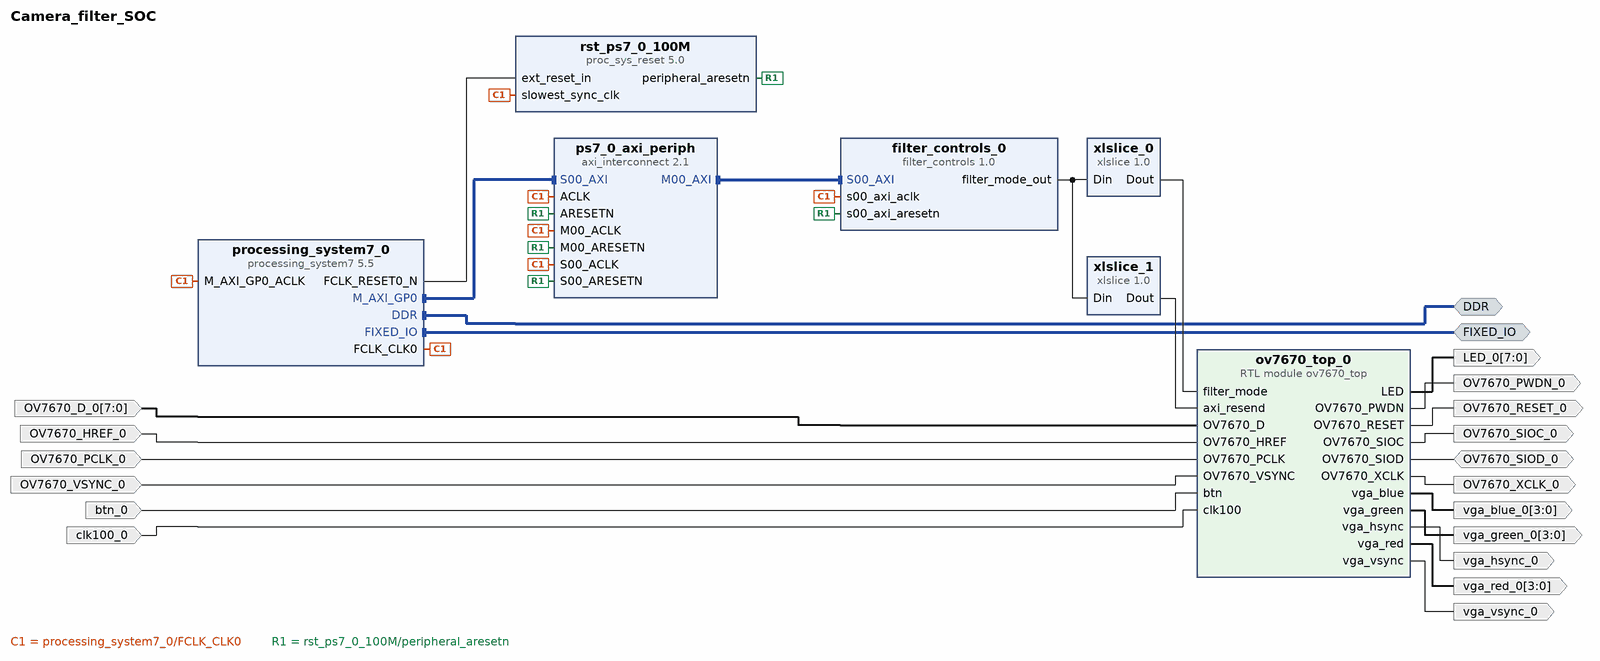
[diagram p0: block diagram of the top level]
# Vivado block design Camera_filter_SOC, xc7z020clg484-1, Vivado 2023.2
create_bd_design Camera_filter_SOC

create_bd_intf_port -mode Master -vlnv xilinx.com:interface:ddrx_rtl:1.0 DDR
create_bd_intf_port -mode Master -vlnv xilinx.com:display_processing_system7:fixedio_rtl:1.0 FIXED_IO
create_bd_port -dir I clk100_0
create_bd_port -dir O OV7670_SIOC_0
create_bd_port -dir IO OV7670_SIOD_0
create_bd_port -dir O -type rst OV7670_RESET_0
create_bd_port -dir O OV7670_PWDN_0
create_bd_port -dir I OV7670_VSYNC_0
create_bd_port -dir I OV7670_HREF_0
create_bd_port -dir I OV7670_PCLK_0
create_bd_port -dir O OV7670_XCLK_0
create_bd_port -dir O -from 7 -to 0 LED_0
create_bd_port -dir I -from 7 -to 0 OV7670_D_0
create_bd_port -dir O -from 3 -to 0 vga_red_0
create_bd_port -dir O -from 3 -to 0 vga_green_0
create_bd_port -dir O -from 3 -to 0 vga_blue_0
create_bd_port -dir O vga_hsync_0
create_bd_port -dir O vga_vsync_0
create_bd_port -dir I btn_0

create_bd_cell -type ip -vlnv xilinx.com:ip:processing_system7:5.5 processing_system7_0
set_property -dict [list \
  CONFIG.PCW_APU_PERIPHERAL_FREQMHZ 650 \
  CONFIG.PCW_ENET0_ENET0_IO {MIO 16 .. 27} \
  CONFIG.PCW_ENET0_GRP_MDIO_ENABLE 1 \
  CONFIG.PCW_ENET0_GRP_MDIO_IO EMIO \
  CONFIG.PCW_ENET0_PERIPHERAL_ENABLE 1 \
  CONFIG.PCW_ENET0_RESET_ENABLE 0 \
  CONFIG.PCW_ENET_RESET_ENABLE 1 \
  CONFIG.PCW_ENET_RESET_SELECT {Share reset pin} \
  CONFIG.PCW_FPGA0_PERIPHERAL_FREQMHZ 100 \
  CONFIG.PCW_GPIO_MIO_GPIO_ENABLE 1 \
  CONFIG.PCW_GPIO_MIO_GPIO_IO MIO \
  CONFIG.PCW_I2C_RESET_ENABLE 1 \
  CONFIG.PCW_PRESET_BANK1_VOLTAGE {LVCMOS 1.8V} \
  CONFIG.PCW_QSPI_GRP_FBCLK_ENABLE 1 \
  CONFIG.PCW_QSPI_GRP_FBCLK_IO {MIO 8} \
  CONFIG.PCW_QSPI_GRP_SINGLE_SS_ENABLE 1 \
  CONFIG.PCW_QSPI_GRP_SINGLE_SS_IO {MIO 1 .. 6} \
  CONFIG.PCW_QSPI_PERIPHERAL_ENABLE 1 \
  CONFIG.PCW_QSPI_QSPI_IO {MIO 1 .. 6} \
  CONFIG.PCW_SD0_GRP_CD_ENABLE 1 \
  CONFIG.PCW_SD0_GRP_CD_IO {MIO 47} \
  CONFIG.PCW_SD0_GRP_WP_ENABLE 1 \
  CONFIG.PCW_SD0_GRP_WP_IO EMIO \
  CONFIG.PCW_SD0_PERIPHERAL_ENABLE 1 \
  CONFIG.PCW_SD0_SD0_IO {MIO 40 .. 45} \
  CONFIG.PCW_SDIO_PERIPHERAL_FREQMHZ 50 \
  CONFIG.PCW_SINGLE_QSPI_DATA_MODE x4 \
  CONFIG.PCW_TTC0_PERIPHERAL_ENABLE 1 \
  CONFIG.PCW_TTC0_TTC0_IO EMIO \
  CONFIG.PCW_UART1_PERIPHERAL_ENABLE 1 \
  CONFIG.PCW_UART1_UART1_IO {MIO 48 .. 49} \
  CONFIG.PCW_UART_PERIPHERAL_FREQMHZ 100 \
  CONFIG.PCW_UIPARAM_DDR_FREQ_MHZ 525 \
  CONFIG.PCW_UIPARAM_DDR_PARTNO {MT41K128M16 JT-125} \
  CONFIG.PCW_USB0_PERIPHERAL_ENABLE 1 \
  CONFIG.PCW_USB0_RESET_ENABLE 1 \
  CONFIG.PCW_USB0_RESET_IO {MIO 46} \
  CONFIG.PCW_USB0_USB0_IO {MIO 28 .. 39} \
  CONFIG.PCW_USB_RESET_ENABLE 1 \
  CONFIG.PCW_USB_RESET_SELECT {Share reset pin} \
] [get_bd_cells processing_system7_0]
# 217 more settings of processing_system7_0 are not shown: defaults, MIO pin electricals, DDR timing, and values the tool derives
create_bd_cell -type ip -vlnv xilinx.com:user:filter_controls:1.0 filter_controls_0
create_bd_cell -type ip -vlnv xilinx.com:ip:axi_interconnect:2.1 ps7_0_axi_periph
set_property -dict {CONFIG.NUM_MI 1} [get_bd_cells ps7_0_axi_periph]
create_bd_cell -type ip -vlnv xilinx.com:ip:proc_sys_reset:5.0 rst_ps7_0_100M
create_bd_cell -type module -reference ov7670_top ov7670_top_0
create_bd_cell -type ip -vlnv xilinx.com:ip:xlslice:1.0 xlslice_0
set_property -dict {CONFIG.DIN_FROM 7 CONFIG.DIN_WIDTH 9} [get_bd_cells xlslice_0]
create_bd_cell -type ip -vlnv xilinx.com:ip:xlslice:1.0 xlslice_1
set_property -dict {CONFIG.DIN_FROM 8 CONFIG.DIN_TO 8 CONFIG.DIN_WIDTH 9} [get_bd_cells xlslice_1]

# ---- connections ----

connect_bd_intf_net [get_bd_intf_ports DDR] [get_bd_intf_pins processing_system7_0/DDR]
connect_bd_intf_net [get_bd_intf_ports FIXED_IO] [get_bd_intf_pins processing_system7_0/FIXED_IO]
connect_bd_intf_net [get_bd_intf_pins processing_system7_0/M_AXI_GP0] [get_bd_intf_pins ps7_0_axi_periph/S00_AXI]
connect_bd_intf_net [get_bd_intf_pins ps7_0_axi_periph/M00_AXI] [get_bd_intf_pins filter_controls_0/S00_AXI]
connect_bd_net [get_bd_ports OV7670_SIOD_0] [get_bd_pins ov7670_top_0/OV7670_SIOD]
connect_bd_net -net OV7670_D_0_1 [get_bd_ports OV7670_D_0] [get_bd_pins ov7670_top_0/OV7670_D]
connect_bd_net -net OV7670_HREF_0_1 [get_bd_ports OV7670_HREF_0] [get_bd_pins ov7670_top_0/OV7670_HREF]
connect_bd_net -net OV7670_PCLK_0_1 [get_bd_ports OV7670_PCLK_0] [get_bd_pins ov7670_top_0/OV7670_PCLK]
connect_bd_net -net OV7670_VSYNC_0_1 [get_bd_ports OV7670_VSYNC_0] [get_bd_pins ov7670_top_0/OV7670_VSYNC]
connect_bd_net -net btn_0_1 [get_bd_ports btn_0] [get_bd_pins ov7670_top_0/btn]
connect_bd_net -net clk100_0_1 [get_bd_ports clk100_0] [get_bd_pins ov7670_top_0/clk100]
connect_bd_net [get_bd_pins filter_controls_0/filter_mode_out] [get_bd_pins xlslice_0/Din] [get_bd_pins xlslice_1/Din]
connect_bd_net [get_bd_pins ov7670_top_0/LED] [get_bd_ports LED_0]
connect_bd_net [get_bd_pins ov7670_top_0/OV7670_PWDN] [get_bd_ports OV7670_PWDN_0]
connect_bd_net [get_bd_pins ov7670_top_0/OV7670_RESET] [get_bd_ports OV7670_RESET_0]
connect_bd_net [get_bd_pins ov7670_top_0/OV7670_SIOC] [get_bd_ports OV7670_SIOC_0]
connect_bd_net [get_bd_pins ov7670_top_0/OV7670_XCLK] [get_bd_ports OV7670_XCLK_0]
connect_bd_net [get_bd_pins ov7670_top_0/vga_blue] [get_bd_ports vga_blue_0]
connect_bd_net [get_bd_pins ov7670_top_0/vga_green] [get_bd_ports vga_green_0]
connect_bd_net [get_bd_pins ov7670_top_0/vga_hsync] [get_bd_ports vga_hsync_0]
connect_bd_net [get_bd_pins ov7670_top_0/vga_red] [get_bd_ports vga_red_0]
connect_bd_net [get_bd_pins ov7670_top_0/vga_vsync] [get_bd_ports vga_vsync_0]
connect_bd_net [get_bd_pins processing_system7_0/FCLK_CLK0] \
  [get_bd_pins processing_system7_0/M_AXI_GP0_ACLK] [get_bd_pins ps7_0_axi_periph/S00_ACLK] \
  [get_bd_pins rst_ps7_0_100M/slowest_sync_clk] [get_bd_pins filter_controls_0/s00_axi_aclk] \
  [get_bd_pins ps7_0_axi_periph/M00_ACLK] [get_bd_pins ps7_0_axi_periph/ACLK]
connect_bd_net [get_bd_pins processing_system7_0/FCLK_RESET0_N] [get_bd_pins rst_ps7_0_100M/ext_reset_in]
connect_bd_net [get_bd_pins rst_ps7_0_100M/peripheral_aresetn] \
  [get_bd_pins ps7_0_axi_periph/S00_ARESETN] [get_bd_pins filter_controls_0/s00_axi_aresetn] \
  [get_bd_pins ps7_0_axi_periph/M00_ARESETN] [get_bd_pins ps7_0_axi_periph/ARESETN]
connect_bd_net [get_bd_pins xlslice_0/Dout] [get_bd_pins ov7670_top_0/filter_mode]
connect_bd_net [get_bd_pins xlslice_1/Dout] [get_bd_pins ov7670_top_0/axi_resend]

# ---- address map ----
assign_bd_address -offset 0x43C00000 -range 64K -target_address_space [get_bd_addr_spaces processing_system7_0/Data] [get_bd_addr_segs filter_controls_0/S00_AXI/S00_AXI_reg]

validate_bd_design
save_bd_design
